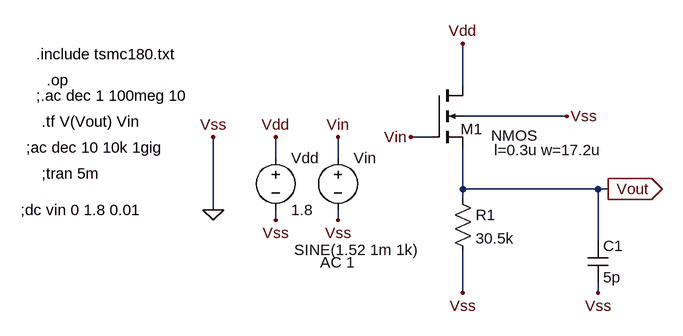
[diagram p0: schematic CD_amp.asc]
CD_amp.asc, the LTspice schematic file:
Version 4
SHEET 1 944 680
WIRE 432 96 432 32
WIRE 592 144 432 144
WIRE 384 176 352 176
WIRE 144 208 144 176
WIRE 240 208 240 176
WIRE 432 256 432 192
WIRE 640 256 432 256
WIRE 656 256 640 256
WIRE 432 272 432 256
WIRE 48 288 48 176
WIRE 144 304 144 288
WIRE 240 304 240 288
WIRE 640 336 640 256
WIRE 432 416 432 352
WIRE 640 416 640 400
FLAG 48 288 0
FLAG 48 176 Vss
FLAG 240 176 Vin
FLAG 144 304 Vss
FLAG 240 304 Vss
FLAG 144 176 Vdd
FLAG 432 32 Vdd
FLAG 352 176 Vin
FLAG 432 416 Vss
FLAG 592 144 Vss
FLAG 656 256 Vout
IOPIN 656 256 Out
FLAG 640 416 Vss
SYMBOL nmos4 384 96 R0
WINDOW 0 45 68 Left 2
WINDOW 3 92 78 Left 2
WINDOW 123 96 100 Left 2
SYMATTR InstName M1
SYMATTR Value2 l=0.3u w=17.2u
SYMBOL voltage 144 192 R0
WINDOW 123 0 0 Left 0
WINDOW 39 0 0 Left 0
SYMATTR InstName Vdd
SYMATTR Value 1.8
SYMBOL voltage 240 192 R0
WINDOW 3 -67 158 Left 2
WINDOW 123 -27 177 Left 2
WINDOW 39 0 0 Left 0
SYMATTR Value SINE(1.52 1m 1k)
SYMATTR Value2 AC 1
SYMATTR InstName Vin
SYMBOL cap 624 336 R0
SYMATTR InstName C1
SYMATTR Value 5p
SYMBOL res 416 256 R0
SYMATTR InstName R1
SYMATTR Value 30.5k
TEXT -224 48 Left 2 !.include tsmc180.txt
TEXT -208 88 Left 2 !.op
TEXT -224 112 Left 2 !;.ac dec 1 100meg 10
TEXT -216 152 Left 2 !.tf V(Vout) Vin
TEXT -240 192 Left 2 !;ac dec 10 10k 1gig
TEXT -216 232 Left 2 !;tran 5m
TEXT -248 288 Left 2 !;dc vin 0 1.8 0.01

The netlist it stands for:
* CD_amp.asc
M1 Vdd Vin Vout 0 NMOS l=0.3u w=17.2u
Vdd Vdd 0 1.8
Vin Vin 0 SINE(1.52 1m 1k) AC 1
C1 Vout 0 5p
R1 Vout 0 30.5k
.model NMOS NMOS
.model PMOS PMOS
.lib standard.mos
.include tsmc180.txt
.op
;.ac dec 1 100meg 10
.tf V(Vout) Vin
;ac dec 10 10k 1gig
;tran 5m
;dc vin 0 1.8 0.01
.backanno
.end